# Altium schematic sheet 9.4 test - I could open it at Uni.SchDoc
size A4
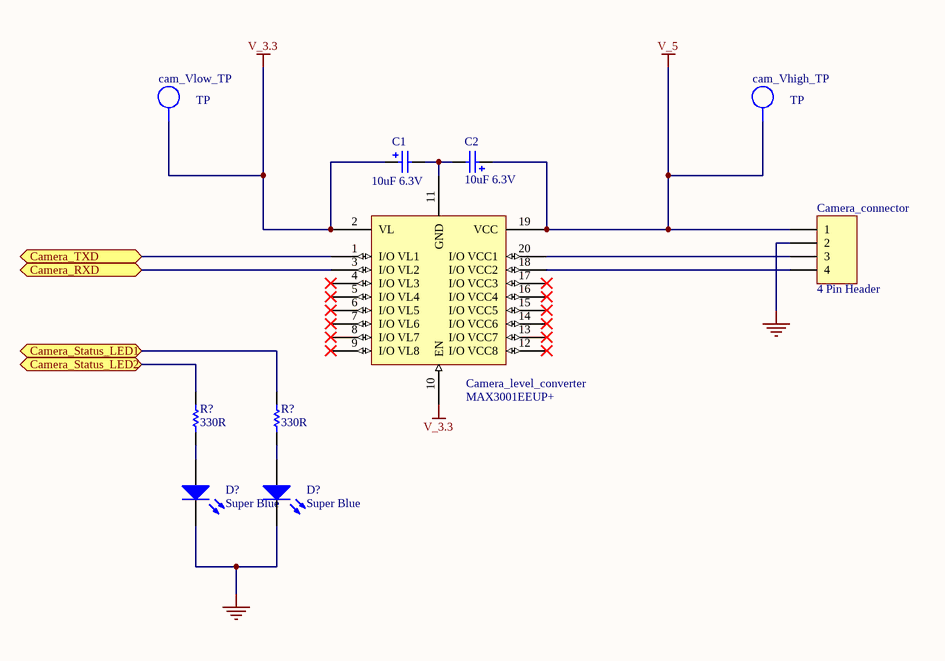
[diagram p0: 9.4 test - I could open it at Uni.SchDoc]

## Parts
(Parts that share a designator on the sheet are numbered #1, #2 ... from top to bottom, then left to right.)
C1  10uF 6.3V  [TANT3216]
C2  10uF 6.3V  [TANT3216]
cam_Vhigh_TP  TP  (no BOM)
cam_Vlow_TP  TP  (no BOM)
Camera_connector  4 Pin Header  [CONN_4X1_SMT_RA_1.25MM]
Camera_level_converter  MAX3001EEUP+  [TSOP65P640X110-20N]
D?#1  Super Blue  [LED0805]
D?#2  Super Blue  [LED0805]
R?#1  330R  [R0603]
R?#2  330R  [R0603]

## Ports
Camera_RXD, Camera_Status_LED1, Camera_Status_LED2, Camera_TXD

## Nets
GND: Camera_connector.2 D?#1.2(K) D?#2.2(K)
V_3.3: C1.1 cam_Vlow_TP.1 Camera_level_converter.2(VL) Camera_level_converter.10(EN)
V_5: C2.1 cam_Vhigh_TP.1 Camera_connector.1 Camera_level_converter.19(VCC)
Camera_RXD: Camera_level_converter.3(I/O_VL2) ; port Camera_RXD
Camera_Status_LED1: R?#2.1 ; port Camera_Status_LED1
Camera_Status_LED2: R?#1.1 ; port Camera_Status_LED2
Camera_TXD: Camera_level_converter.1(I/O_VL1) ; port Camera_TXD
NetC1_2: C1.2 C2.2 Camera_level_converter.11(GND)
NetCamera_connector_3: Camera_connector.3 Camera_level_converter.20(I/O_VCC1)
NetCamera_connector_4: Camera_connector.4 Camera_level_converter.18(I/O_VCC2)
NetD?#1_1: D?#1.1(A) R?#1.2
NetD?#2_1: D?#2.1(A) R?#2.2

Not connected (* = marked no-connect by the designer): Camera_level_converter 4(I/O_VL3)* 5(I/O_VL4)* 6(I/O_VL5)* 7(I/O_VL6)* 8(I/O_VL7)* 9(I/O_VL8)* 12(I/O_VCC8)* 13(I/O_VCC7)* 14(I/O_VCC6)* 15(I/O_VCC5)* 16(I/O_VCC4)* 17(I/O_VCC3)*

## Library data of the parts
C1 C2 = TANT10uF_6.3V_3216: SM Tantalum Cap; Supplier_Component_Code: RZ-6541; published: 12/03/2007 11:34:36 a.m.; Supplier_Name: Soanar Plus; price: 1.7; value: 10uF 6.3V; Part Number: TANT10uF_6.3V_3216; Component Kind: Standard; Component Type: Standard; Designator: TANT10uF_6.3V_3216; Pin Count: 2
cam_Vhigh_TP cam_Vlow_TP = TP_TESTPOINT: Test-Point; LatestRevisionDate: 29 May 08; Manufacturer PN: *; Manufacturer: *; Supplier 1: Digi-Key; Supplier Part Number 1: 5016KTR-ND; Value: TP
Camera_connector = JP_4PIN HDR_SMT_RA_MOLEX_1: CONN HDR VERT 4POS .100" SNGL; Manufacturer: Molex; Manufacturer PN: 53261-0471; Verify: Not Checked; LatestRevisionDate: 24 Jun 08; Supplier_Component_Code: WM7622CT-ND; Supplier_Name: Digikey; Supplier 1: Digi-Key; Supplier Part Number 1: WM7622CT-ND; Value: 4 Pin Header
D?#1 D?#2 = LED0805_S_BLUE: LED 0805 Super Blue; component_type: Opto; ECE_Component_Code: LED0805_S_BLUE; Supplier_Component_Code: ZD-P030; published: 12/03/2007 11:34:37 a.m.; Supplier_Name: Soanar Plus; price: 1.91; value: Super Blue; Part Number: LED0805_S_BLUE; Component Kind: Standard; Component Type: Standard; Designator: LED0805_S_BLUE; Pin Count: 2
R?#1 R?#2 = 330R_R0603: 0603 Resistor; ECE_Component_Code: 330R_R0603; value: 330R; Supplier_Component_Code: RS-S061; published: 12/03/2007 11:34:34 a.m.; Supplier_Name: Soanar Plus; price: 0.08; Part Number: 330R_R0603; Component Kind: Standard; Component Type: Standard; Designator: 330R_R0603; Pin Count: 2